# EAGLE design LED_Controller (EAGLE 6.3)
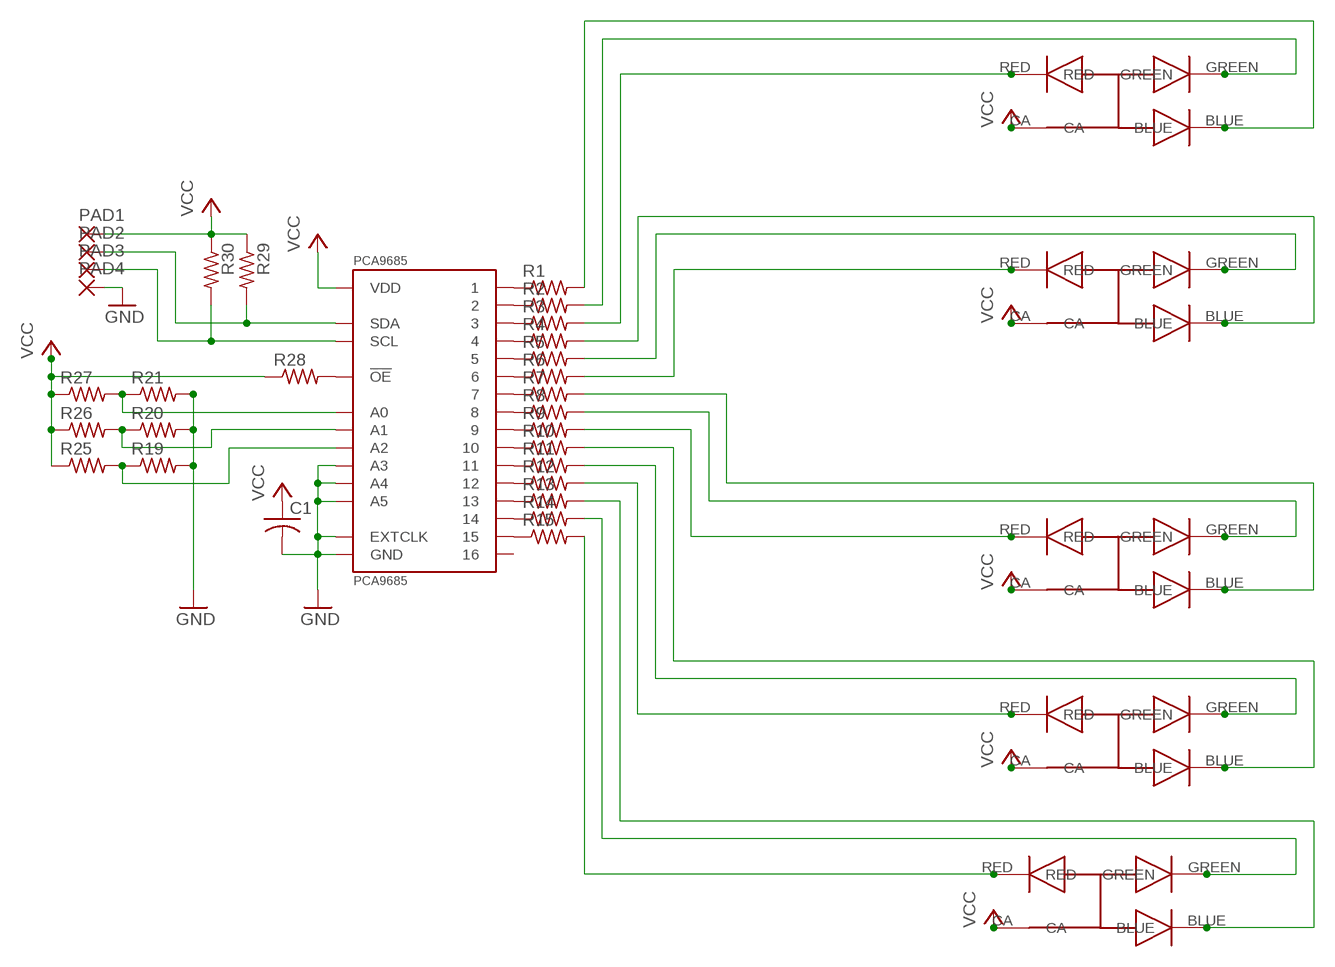
[diagram p0: schematic, sheet 1]

## Parts
C1  C-USC0402  [C0402]
PAD1  SMD2  [SMD1,27-2,54]
PAD2  SMD2  [SMD1,27-2,54]
PAD3  SMD2  [SMD1,27-2,54]
PAD4  SMD2  [SMD1,27-2,54]
PCA9685  PCA9685  [HVQFN28]
R1  R-US_R0402  [R0402]
R2  R-US_R0402  [R0402]
R3  R-US_R0402  [R0402]
R4  R-US_R0402  [R0402]
R5  R-US_R0402  [R0402]
R6  R-US_R0402  [R0402]
R7  R-US_R0402  [R0402]
R8  R-US_R0402  [R0402]
R9  R-US_R0402  [R0402]
R10  R-US_R0402  [R0402]
R11  R-US_R0402  [R0402]
R12  R-US_R0402  [R0402]
R13  R-US_R0402  [R0402]
R14  R-US_R0402  [R0402]
R15  R-US_R0402  [R0402]
R19  R-US_R0402  [R0402]
R20  R-US_R0402  [R0402]
R21  R-US_R0402  [R0402]
R25  R-US_R0402  [R0402]
R26  R-US_R0402  [R0402]
R27  R-US_R0402  [R0402]
R28  R-US_R0402  [R0402]
R29  R-US_R0402  [R0402]
R30  R-US_R0402  [R0402]
U$2  CLV1A-FKB  [CLV1A-FKB]
U$3  CLV1A-FKB  [CLV1A-FKB]
U$4  CLV1A-FKB  [CLV1A-FKB]
U$5  CLV1A-FKB  [CLV1A-FKB]
U$6  CLV1A-FKB  [CLV1A-FKB]

## Nets
GND: C1.2 PAD4.1(P) PCA9685.4(A3) PCA9685.5(A4) PCA9685.14(GND) PCA9685.24(A5) PCA9685.25(EXTCLK) PCA9685.PAD(GND) R19.2 R20.2 R21.2
N$1: R7.2 U$4.BLUE
N$2: R2.2 U$6.GREEN
N$3: PCA9685.2(A1) R20.1 R26.2
N$4: R15.2 U$2.RED
N$5: R14.2 U$2.GREEN
N$6: R13.2 U$2.BLUE
N$7: PCA9685.6 R1.1
N$8: PCA9685.7 R2.1
N$9: PCA9685.8 R3.1
N$10: R12.2 U$3.RED
N$11: R11.2 U$3.GREEN
N$12: R10.2 U$3.BLUE
N$13: PCA9685.9 R4.1
N$14: PCA9685.10 R5.1
N$15: PCA9685.11 R6.1
N$16: R9.2 U$4.RED
N$17: R8.2 U$4.GREEN
N$18: PCA9685.12 R7.1
N$19: PCA9685.13 R8.1
N$20: PCA9685.15 R9.1
N$21: PCA9685.16 R10.1
N$22: R6.2 U$5.RED
N$23: R5.2 U$5.GREEN
N$24: R4.2 U$5.BLUE
N$25: PCA9685.17 R11.1
N$26: PCA9685.18 R12.1
N$27: PCA9685.19 R13.1
N$28: R3.2 U$6.RED
N$29: PCA9685.20 R14.1
N$30: PCA9685.21 R15.1
N$31: R1.2 U$6.BLUE
N$38: PCA9685.23(!OE) R28.2
N$39: PCA9685.3(A2) R19.1 R25.2
N$41: PAD2.1(P) PCA9685.27(SDA) R29.2
N$43: PAD3.1(P) PCA9685.26(SCL) R30.2
N$45: PCA9685.1(A0) R21.1 R27.2
VCC: C1.1 PAD1.1(P) PCA9685.28(VDD) R25.1 R26.1 R27.1 R28.1 R29.1 R30.1 U$2.CA U$3.CA U$4.CA U$5.CA U$6.CA
Unconnected: PCA9685.22

## Library data of the parts
C1 = resistor:C-US: CAPACITOR, American symbol
PAD1-PAD4 = wirepad:SMD2: SMD PAD
PCA9685 = nxp:PCA9685
R1-R15 R19-R21 R25-R30 = resistor:R-US_: RESISTOR, American symbol
U$2-U$6 = SYNShop:CLV1A-FKB: Cree PLCC4 3 in 1 SMD LED CLV1A-FKB

## Board
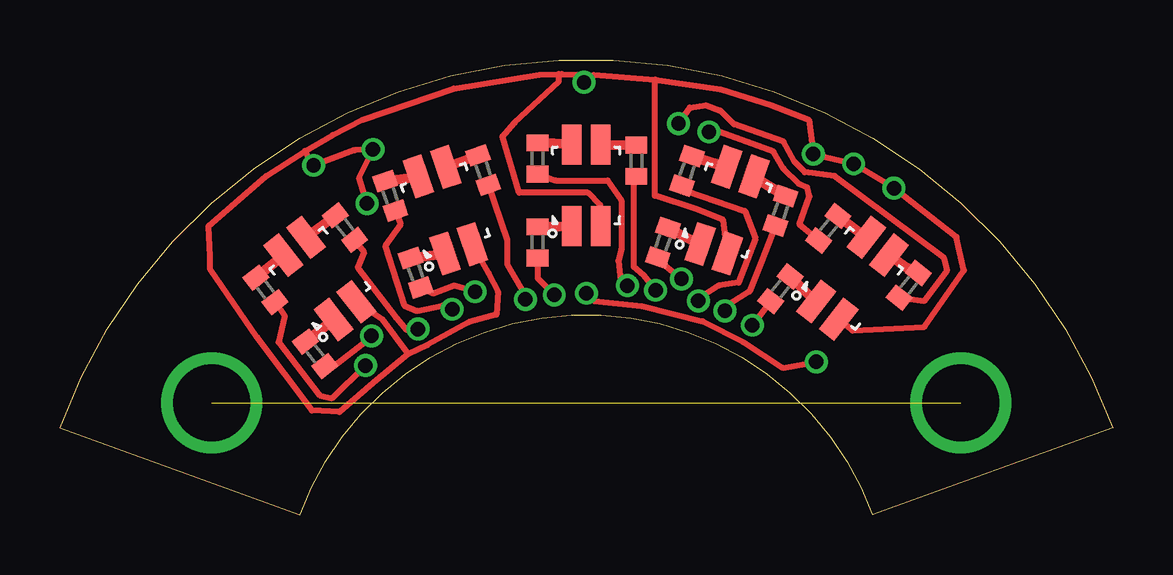
[diagram p1: board, top side]
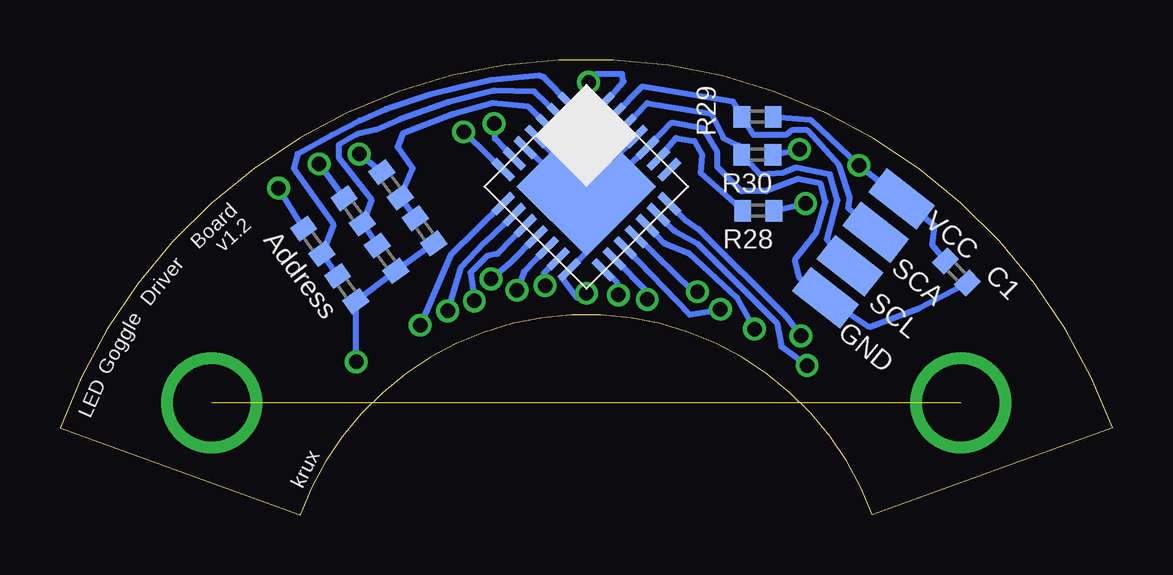
[diagram p2: board, bottom side, seen from below]

Size 43.88 x 18.98 mm. Coordinates in mm from the lower left corner, seen from the top.
Outline: 0,3.64 arc-140 43.88,3.64 33.87,0 arc140 10,0 0,3.64
Copper layers (1*16): Top 0.0356mm / dielectric 1.5011mm / Bottom 0.0356mm
Design rules "LaenPCBOrder": minimum track width 6mil, minimum drill 13mil, track to track 6mil, track to pad 6mil, pad to pad 6mil, via to via 6mil, smd to smd 6mil, copper to edge 15mil, drill to drill 6mil, minimum pad ring 7mil, minimum via ring 7mil, stop-mask expansion 4mil, vias tented up to drill 0mil, thermal gap 10mil
tKeepout: area 33.8,0.9 to 41.4,8.5; area 2.5,0.9 to 10.1,8.5

### Footprints (pad centres in the part's own frame; a part is rotated, then mirrored left to right if it is on the bottom)
C0402 = smd 0.7 x 0.9: 1 -0.65,0; 2 0.65,0
SMD1,27-2,54 = smd 1.27 x 2.54: 1 0,0
HVQFN28 = smd 1.1 x 0.3: 1 -2.95,1.95; 2 -2.95,1.3; 3 -2.95,0.65; 4 -2.95,0; 5 -2.95,-0.65; 6 -2.95,-1.3; 7 -2.95,-1.95; 15 2.95,-1.95; 16 2.95,-1.3; 17 2.95,-0.65; 18 2.95,0; 19 2.95,0.65; 20 2.95,1.3; 21 2.95,1.95 | smd 0.3 x 1.1: 8 -1.95,-2.95; 9 -1.3,-2.95; 10 -0.65,-2.95; 11 0,-2.95; 12 0.65,-2.95; 13 1.3,-2.95; 14 1.95,-2.95; 22 1.95,2.95; 23 1.3,2.95; 24 0.65,2.95; 25 0,2.95; 26 -0.65,2.95; 27 -1.3,2.95; 28 -1.95,2.95 | smd 4.1 x 4.1: PAD 0,0
R0402 = smd 0.7 x 0.9: 1 -0.65,0; 2 0.65,0
CLV1A-FKB = smd 1.676 x 0.813: BLUE 1.7,-0.597; CA -1.7,-0.597; GREEN 1.7,0.603; RED -1.7,0.603

### Placement (x,y rotation side)
C1  6.51,10.13 315 bottom
PAD1  8.79,13.18 52 bottom
PAD2  9.87,11.79 52 bottom
PAD3  10.95,10.39 52 bottom
PAD4  11.97,9.05 52 bottom
PCA9685  21.94,13.69 315 bottom
R1  35.38,9.58 52 top
R2  32.03,11.96 52 top
R3  30.03,9.43 52 top
R4  30.04,12.68 71 top
R5  26.14,14.35 71 top
R6  25.13,11.35 71 top
R7  24.03,14.77 90 top
R8  19.9,14.87 90 top
R9  19.9,11.37 90 top
R10  17.64,14.38 109 top
R11  13.77,13.32 109 top
R12  14.83,10.1 109 top
R13  11.88,11.98 128 top
R14  8.57,9.39 128 top
R15  10.64,6.72 128 top
R19  28.68,11.85 306 bottom
R20  30.26,10.71 306 bottom
R21  31.92,9.44 306 bottom
R25  30.07,13.77 306 bottom
R26  31.65,12.68 306 bottom
R27  33.34,11.41 306 bottom
R28  14.77,12.69 180 bottom
R29  14.8,16.61 180 bottom
R30  14.81,15.02 180 bottom
U$2  10.84,9.87 128 top
U$3  16.07,12.71 109 top
U$4  21.94,13.75 90 top
U$5  27.81,12.71 71 top
U$6  33.04,9.87 52 top

### Tracks (layer width: path | path; a pad name or v marks a point on that pad's centre or on a via)
GND  (via drill 0.6)
  Top 0.254: v21.94,9.25 22.26,8.93 24.26,8.71 26.8,8.07 28.48,7.21 30.13,6.13 v31.53,6.39
  Bottom 0.254: R19.2 R20.2 R21.2 v31.53,6.39 | PCA9685.4 22.83,14.58 | 22.83,14.58 22.57,14.33 23.08,15.02 | PCA9685.5 23.27,14.2 23.27,14.13 22.83,14.58 | PCA9685.25 20.92,14.71 | 20.92,14.71 PCA9685.PAD 21.94,10.96 PCA9685.14 22.95,9.88 22.32,9.05 v21.94,9.25 | PCA9685.24 20.92,13.88 22.83,14.58 | C1.2 8.1,8.61 10.13,7.85 PAD4.1 13.05,9.88 13.24,10.64 12.35,11.79 11.97,13.06 12.16,13.82 13.11,14.01 14.45,13.5 15.46,13.5 16.48,14.52 16.48,15.15 17.05,16.1 18.38,16.36 PCA9685.24 | PCA9685.24 20.41,14.33 20.92,14.71
N$1
  Top 0.406: U$4.BLUE R7.2
N$2
  Top 0.406: R2.2 U$6.GREEN
N$3
  Bottom 0.254: R20.1 R26.2 30.89,13.15 32.26,14.9 32.26,15.44 31.5,15.88 30.67,16.07 29.69,16.52 27.69,17.21 25.78,17.69 24.1,17.66 PCA9685.2
N$4
  Top 0.406: R15.2 U$2.RED
N$5
  Top 0.406: R14.2 U$2.GREEN
N$6
  Top 0.406: R13.2 U$2.BLUE
N$7  (via drill 0.6)
  Top 0.254: R1.1 36.04,8.93 36.99,10.2 36.86,10.71 32.29,14.13 31.05,14.29 30.61,14.74 30.16,15.56 28.1,16.29 27.53,16.87 26.92,17.09 26.26,16.99 v25.78,16.33
  Bottom 0.254: PCA9685.6 25.75,15.69 v25.78,16.33
N$8  (via drill 0.6)
  Top 0.254: R2.1 30.83,12.1 31.24,13.28 31.15,13.66 30.8,13.82 30.16,14.45 29.75,15.15 27.27,16.04 v27.05,15.98
  Bottom 0.254: PCA9685.7 26.89,15.85 v27.05,15.98
N$9  (via drill 0.6)
  Top 0.254: R3.1 v28.86,7.91
  Bottom 0.254: PCA9685.8 26.51,11.91 27.59,10.83 28.51,8.71 v28.86,7.91
N$10
  Top 0.406: R12.2 U$3.RED
N$11
  Top 0.406: R11.2 U$3.GREEN
N$12
  Top 0.406: U$3.BLUE R10.2
N$13  (via drill 0.6)
  Top 0.254: R4.1 29.24,10.58 28.73,9.31 27.72,8.67 v27.72,8.52
  Bottom 0.254: PCA9685.9 26.19,11.34 27.18,10.29 27.46,9.34 v27.72,8.52
N$14  (via drill 0.6)
  Top 0.254: R5.1 26.13,13.5 28.54,12.67 28.99,11.53 28.29,9.69 27.46,9.56 26.83,9.15 v26.61,8.93
  Bottom 0.254: PCA9685.10 25.62,10.9 26.07,10.8 26.76,10.1 v26.61,8.93
N$15  (via drill 0.6)
  Top 0.254: R6.1 25.24,10.39 v25.91,9.85
  Bottom 0.254: PCA9685.11 25.11,10.52 v25.91,9.85
N$16
  Top 0.406: R9.2 U$4.RED
N$17
  Top 0.406: U$4.GREEN R8.2
N$18  (via drill 0.6)
  Top 0.254: R7.1 23.91,13.75 23.91,10.36 24.35,9.98 v24.83,9.37
  Bottom 0.254: PCA9685.12 24.54,10.13 v24.83,9.37
N$19  (via drill 0.6)
  Top 0.254: R8.1 20.67,13.94 22.83,13.94 23.4,13.12 23.4,11.09 23.27,10.61 23.37,9.79 v23.65,9.56
  Bottom 0.254: PCA9685.13 23.72,10.07 v23.65,9.56
N$20  (via drill 0.6)
  Top 0.254: R9.1 19.91,9.88 v20.61,9.18
  Bottom 0.254: PCA9685.15 20.67,9.69 v20.61,9.18
N$21  (via drill 0.6)
  Top 0.254: R10.1 18.64,11.47 18.64,10.45 19.34,9.25 v19.4,8.99
  Bottom 0.254: PCA9685.16 19.4,9.31 v19.4,8.99
N$22
  Top 0.406: R6.2 U$5.RED
N$23
  Top 0.406: R5.2 U$5.GREEN
N$24
  Top 0.406: U$5.BLUE R4.2
N$25  (via drill 0.6)
  Top 0.254: R11.1 14.19,12.1 13.56,11.21 14.35,8.74 14.89,8.52 15.97,8.74 v16.35,8.58
  Bottom 0.254: PCA9685.17 17.62,8.36 v16.35,8.58
N$26  (via drill 0.6)
  Top 0.254: R12.1 15.52,9.25 16.41,9.56 v17.3,9.31
  Bottom 0.254: PCA9685.18 17.49,9.31 v17.3,9.31
N$27  (via drill 0.6)
  Top 0.254: R13.1 12.67,10.96 12.41,10.33 14,8.23 14.45,7.72 v14.92,7.75
  Bottom 0.254: PCA9685.19 18.7,11.34 17.68,10.93 15.65,9.05 v14.92,7.75
N$28
  Top 0.406: R3.2 U$6.RED
N$29  (via drill 0.6)
  Top 0.254: R14.1 9.37,8.29 9.11,7.21 10.83,4.99 11.33,4.86 v12.73,6.23
  Bottom 0.254: PCA9685.20 18.26,11.85 17.3,11.31 14,8.01 13.81,7.02 v12.73,6.23
N$30  (via drill 0.6)
  Top 0.254: R15.1 11.33,6.32 11.4,6.2 12.79,7.28 v12.99,7.47
  Bottom 0.254: PCA9685.21 17.81,12.29 17.24,11.91 13.62,8.29 v12.99,7.47
N$31
  Top 0.406: R1.2 35.27,10.33 U$6.BLUE
N$38
  Bottom 0.254: PCA9685.23 18.19,15.72 17.43,15.6 17.11,15.02 17.18,14.26 R28.2
N$39
  Bottom 0.254: R19.1 R25.2 29.18,14.45 29.81,15.34 29.59,15.91 27.49,16.71 25.84,17.18 24.35,17.02 PCA9685.3
N$40  (via drill 3.2)  (1 unrouted)
  other vias: 6.32,4.67 37.56,4.67
N$41
  Bottom 0.254: PCA9685.27 19.59,17.88 15.84,17.25 R29.2 14.95,15.85 13.62,15.85 13.37,16.04 12.73,16.04 11.4,14.58 10.95,13.25 11.02,12.8 PAD2.1
N$43
  Bottom 0.254: PCA9685.26 19.4,17.18 16.73,16.74 16.22,15.72 15.59,15.41 R30.2 14.7,14.2 13.75,14.26 13.21,14.48 11.78,14.2 11.46,13.12 11.91,11.47 PAD3.1
N$45
  Bottom 0.254: R21.1 R27.2 32.48,12.1 34.13,14.45 33.97,15.06 32.54,15.85 31.37,16.45 30.32,16.9 28.45,17.53 27.18,17.85 25.91,18.14 23.91,18.33 23.72,18.26 PCA9685.1
VCC  (via drill 0.6)
  Top 0.254: 24.81,18.16 22.26,18.36 v21.84,18.04 21.65,18.36 | 24.81,18.16 27.53,17.75 29.65,17.09 31.21,16.48 v31.4,15.06 v33.08,14.64 v34.77,13.63 37.37,11.6 37.69,10.2 36.04,7.85 33.05,7.69 U$6.CA | U$4.CA 22.51,12.93 22,13.44 19.14,13.44 18.45,15.79 18.95,16.36 20.8,18.07 20.8,18.39 21.65,18.36 | U$5.CA 27.65,12.29 26.57,12.74 24.8,13.31 24.8,17.69 24.81,18.16 | U$2.CA 13.43,8.17 14.51,6.71 | 14.51,6.71 13.05,5.5 11.65,4.29 10.51,4.36 8.22,7.4 6.25,10.26 6.25,10.77 6.19,12.04 8.6,14.13 10.21,15.18 | 10.21,15.18 11.37,15.85 12.6,16.48 16.41,17.79 19.97,18.36 20.92,18.39 21.65,18.36 | U$3.CA 17.87,10.07 18.26,9.31 18.19,8.36 17.05,8.04 15.3,7.09 14.51,6.71 | 10.21,15.18 v10.57,14.58 12.29,15.21 v13.05,15.25 12.48,14.07 v12.79,12.99
  Bottom 0.254: R25.1 v31.4,15.06 | v33.08,14.64 R26.1 | R27.1 v34.77,13.63 | PCA9685.28 21.3,17.06 20.67,17.75 20.38,18.07 20.45,18.39 21.53,18.39 v21.84,18.04 | C1.1 7.52,11.28 7.43,12.07 PAD1.1 v10.57,14.58 12.6,16.48 R29.1 | R30.1 v13.05,15.25 | R28.1 v12.79,12.99

### Text on the board
_bsilk: Address | VCC | v1.2 | Board | SCA | Driver | SCL | GND | Goggle | LED | krux